# Altium schematic sheet 03_RADIO.SchDoc
size A4
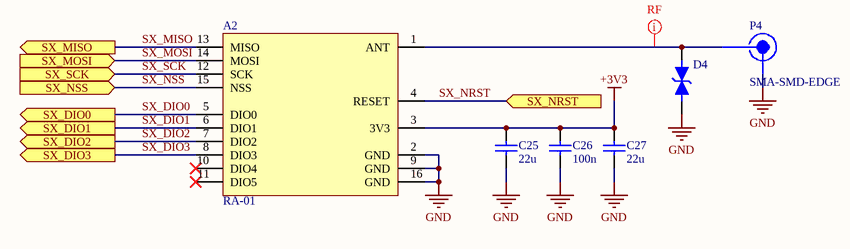
[diagram p0: 03_RADIO.SchDoc]

## Parts
A2  RA-01  [RA-01]
C25  22u  [C0805_IPC_HD]
C26  100n  [C0603_IPC_MD]
C27  22u  [C0805_IPC_HD]
D4  LXES15AAA1-153  [C0402_IPC_MD]  (value not drawn)  (no BOM)
P4  SMA-SMD-EDGE  [SMA-SMD-EDGE]

## Ports
SX_DIO0 (out), SX_DIO1 (out), SX_DIO2 (out), SX_DIO3 (out), SX_MISO (out), SX_MOSI (in), SX_NRST (in), SX_NSS (in), SX_SCK (in)

## Nets
+3V3: A2.3(3V3) C25.1 C26.1 C27.1
GND: A2.2(GND) A2.9(GND) A2.16(GND) C25.2 C26.2 C27.2 D4.1 P4.1
SX_DIO0: A2.5(DIO0) ; port SX_DIO0
SX_DIO1: A2.6(DIO1) ; port SX_DIO1
SX_DIO2: A2.7(DIO2) ; port SX_DIO2
SX_DIO3: A2.8(DIO3) ; port SX_DIO3
SX_MISO: A2.13(MISO) ; port SX_MISO
SX_MOSI: A2.14(MOSI) ; port SX_MOSI
SX_NRST: A2.4(RESET) ; port SX_NRST
SX_NSS: A2.15(NSS) ; port SX_NSS
SX_SCK: A2.12(SCK) ; port SX_SCK
NetA2_1: A2.1(ANT) D4.2 P4.2

Not connected (* = marked no-connect by the designer): A2 10(DIO4)* 11(DIO5)*

## Layout directives
net class RF50: NetA2_1

## Library data of the parts
A2 = RA-01: Wireless Modules SX1278; Manufacturer: Ai-Thinker; Manufacturer Part Number: RA-01; Supplier 1: LCSC; Supplier Part Number 1: C90040
C25 C27 = CL21A226MOCLRNC: CAP CER 22UF 16V X5R 0805; Manufacturer: Samsung Electro-Mechanics; Manufacturer Part Number: CL21A226MOCLRNC; Voltage: 16V; Value: 22u; Dielectric: X5R; Supplier 1: Digi-Key; Supplier Part Number 1: 1276-6780-1-ND
C26 = CL10B104KO8NNNC: CAP CER 0.1UF 16V X7R 0603; Manufacturer: Samsung Electro-Mechanics; Manufacturer Part Number: CL10B104KO8NNNC; Voltage: 16V; Value: 100n; Dielectric: X7R; Supplier 1: Digi-Key; Supplier Part Number 1: 1276-1005-1-ND
D4 = LXES15AAA1-153: TVS DIODE 4V 0402; Manufacturer: Murata Electronics North America; Manufacturer Part Number: LXES15AAA1-153; Voltage - Reverse Standoff (Typ): 4V; Supplier 1: Digi-Key; Supplier Part Number 1: 490-13210-1-ND
P4 = SMA-SMD-EDGE: SMA SMD EDGE CONNECTER; Manufacturer: China; Manufacturer Part Number: SMA-SMD-EDGE; Supplier 1: Aliexpress; Supplier Part Number 1: SMA-SMD-EDGE